# Altium schematic sheet Э3-9.SchDoc
size 594 x 420 mm; Address1: Address1; Address2: Address2; Address3: Address3; Address4: Address4; SheetNumber: 9; SheetTotal: 12; DocumentType: Схема электрическая принципиальная
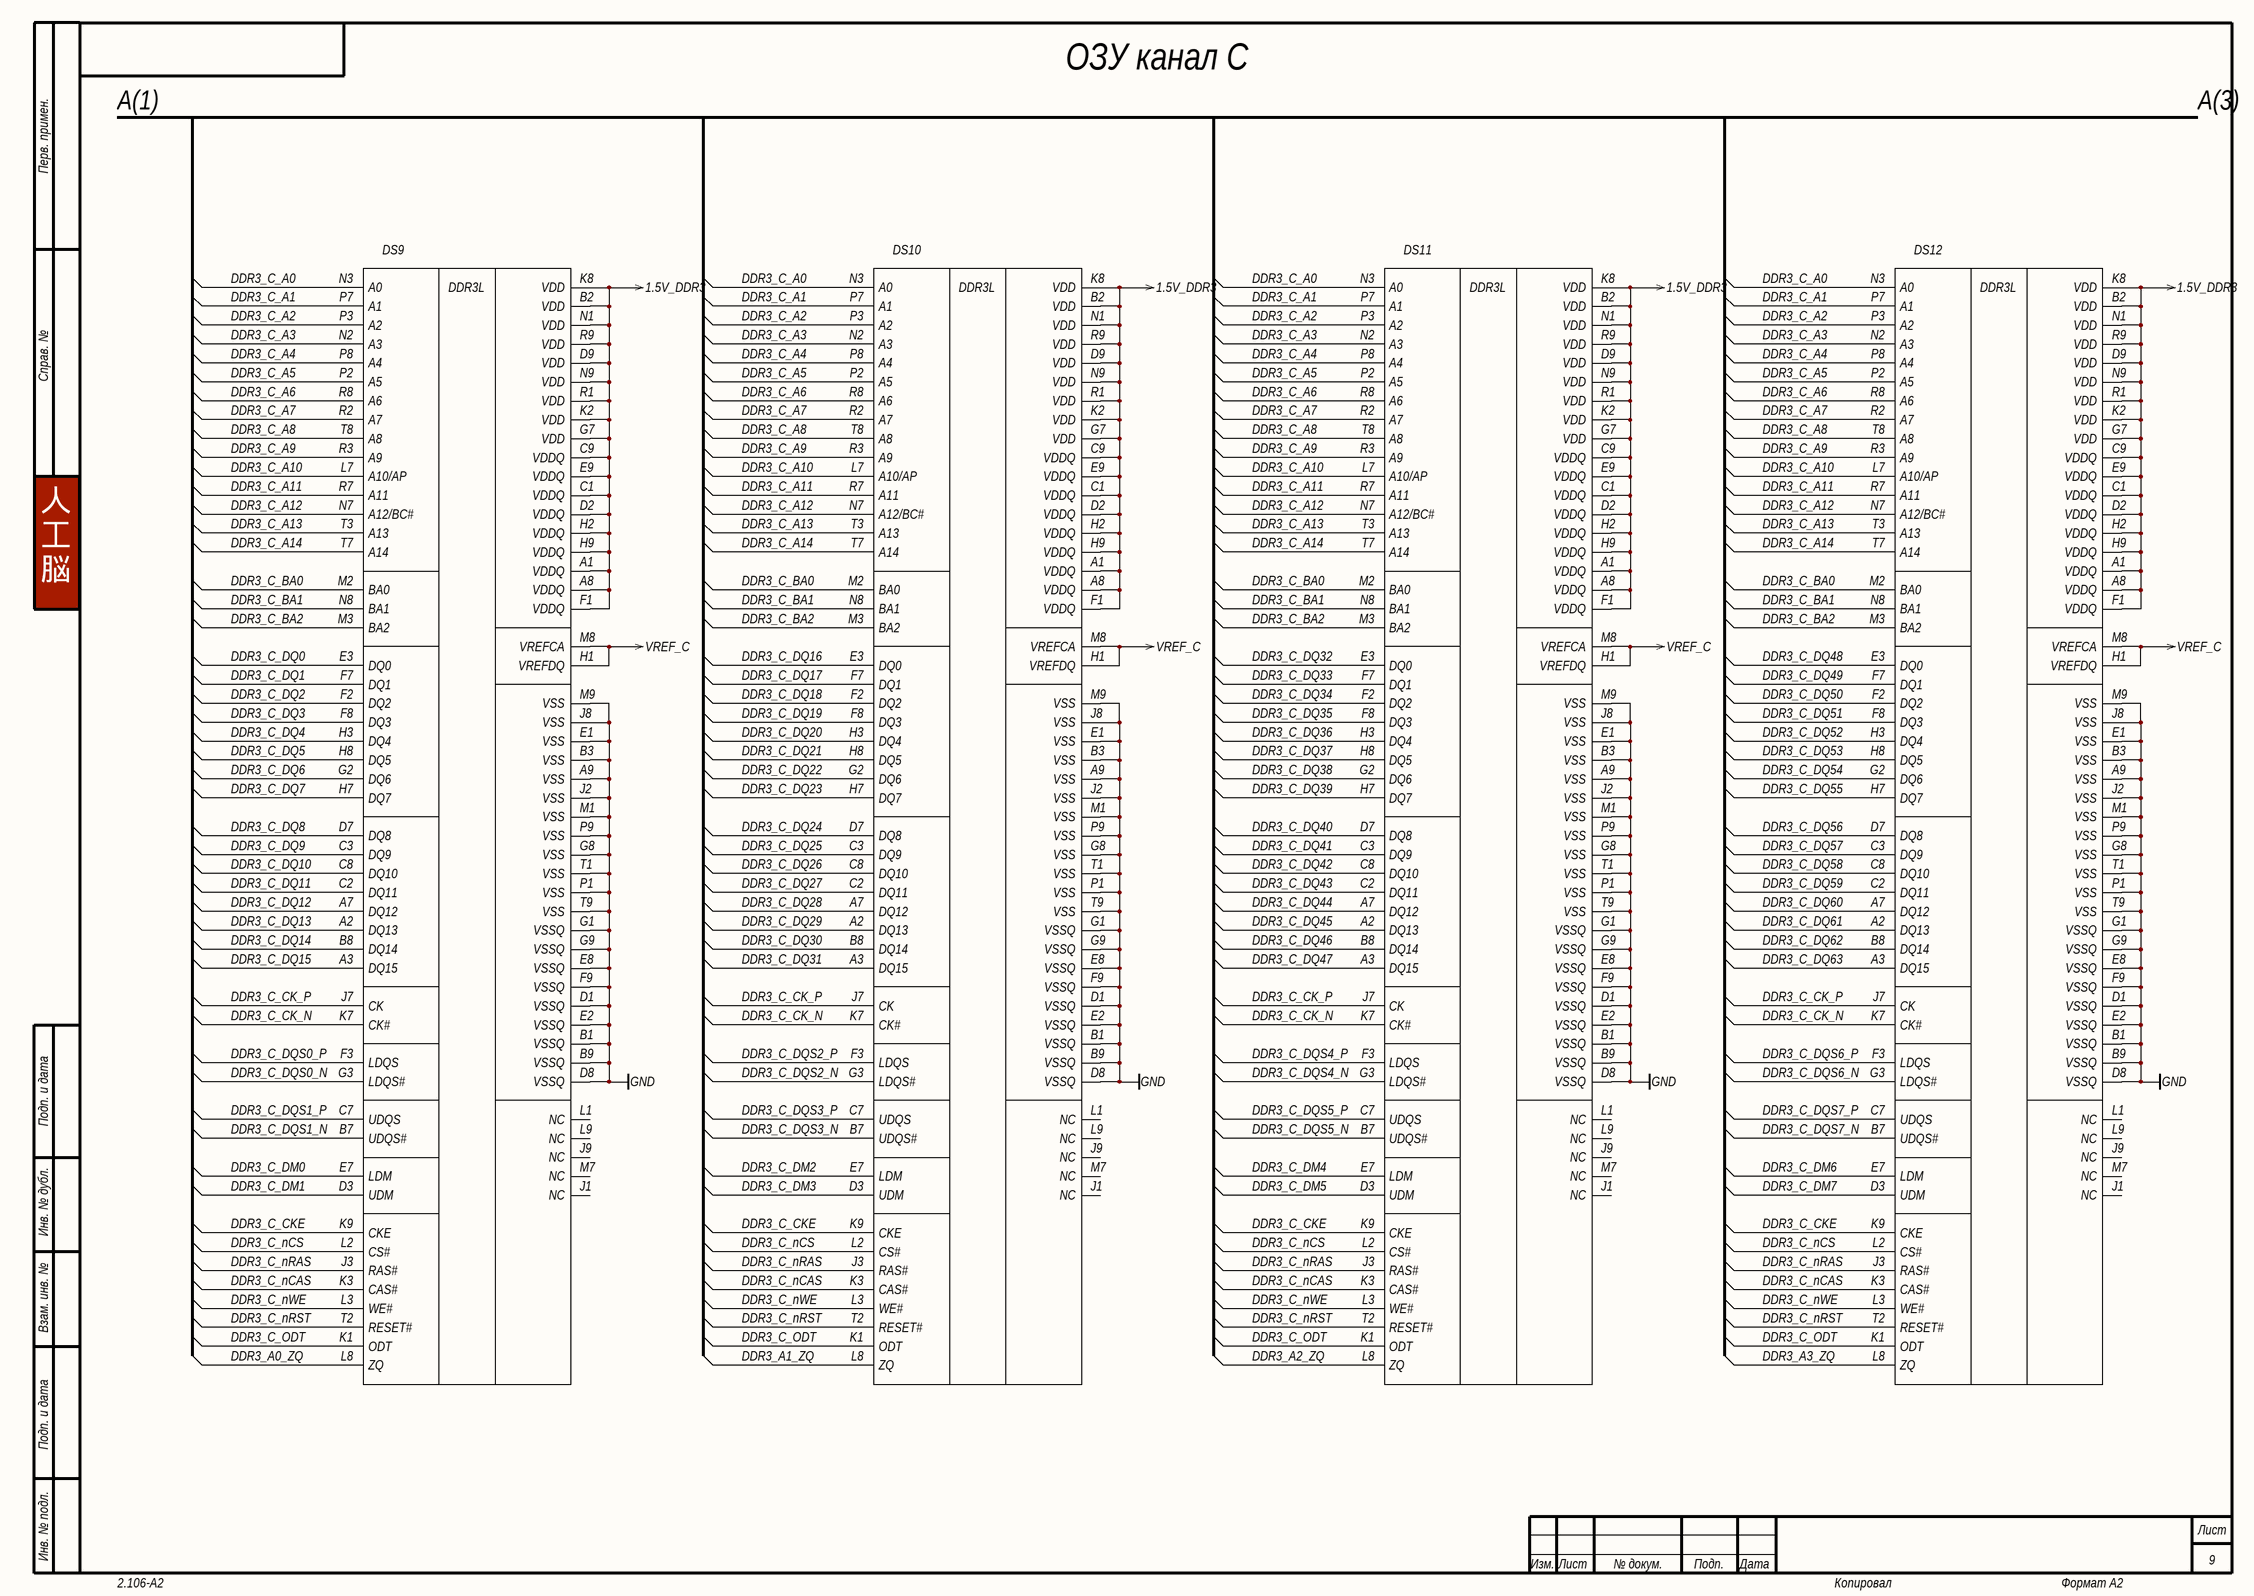
[diagram p0: Э3-9.SchDoc]

## Parts
DS9  1  [96-FBGA]  (value not drawn)
DS10  1  [96-FBGA]  (value not drawn)
DS11  1  [96-FBGA]  (value not drawn)
DS12  1  [96-FBGA]  (value not drawn)

## Nets
1.5V_DDR3: DS9.A1(VDDQ) DS9.A8(VDDQ) DS9.B2(VDD) DS9.C1(VDDQ) DS9.C9(VDDQ) DS9.D2(VDDQ) DS9.D9(VDD) DS9.E9(VDDQ) DS9.F1(VDDQ) DS9.G7(VDD) DS9.H2(VDDQ) DS9.H9(VDDQ) DS9.K2(VDD) DS9.K8(VDD) DS9.N1(VDD) DS9.N9(VDD) DS9.R1(VDD) DS9.R9(VDD) DS10.A1(VDDQ) DS10.A8(VDDQ) DS10.B2(VDD) DS10.C1(VDDQ) DS10.C9(VDDQ) DS10.D2(VDDQ) DS10.D9(VDD) DS10.E9(VDDQ) DS10.F1(VDDQ) DS10.G7(VDD) DS10.H2(VDDQ) DS10.H9(VDDQ) DS10.K2(VDD) DS10.K8(VDD) DS10.N1(VDD) DS10.N9(VDD) DS10.R1(VDD) DS10.R9(VDD) DS11.A1(VDDQ) DS11.A8(VDDQ) DS11.B2(VDD) DS11.C1(VDDQ) DS11.C9(VDDQ) DS11.D2(VDDQ) DS11.D9(VDD) DS11.E9(VDDQ) DS11.F1(VDDQ) DS11.G7(VDD) DS11.H2(VDDQ) DS11.H9(VDDQ) DS11.K2(VDD) DS11.K8(VDD) DS11.N1(VDD) DS11.N9(VDD) DS11.R1(VDD) DS11.R9(VDD) DS12.A1(VDDQ) DS12.A8(VDDQ) DS12.B2(VDD) DS12.C1(VDDQ) DS12.C9(VDDQ) DS12.D2(VDDQ) DS12.D9(VDD) DS12.E9(VDDQ) DS12.F1(VDDQ) DS12.G7(VDD) DS12.H2(VDDQ) DS12.H9(VDDQ) DS12.K2(VDD) DS12.K8(VDD) DS12.N1(VDD) DS12.N9(VDD) DS12.R1(VDD) DS12.R9(VDD)
GND: DS9.A9(VSS) DS9.B1(VSSQ) DS9.B3(VSS) DS9.B9(VSSQ) DS9.D1(VSSQ) DS9.D8(VSSQ) DS9.E1(VSS) DS9.E2(VSSQ) DS9.E8(VSSQ) DS9.F9(VSSQ) DS9.G1(VSSQ) DS9.G8(VSS) DS9.G9(VSSQ) DS9.J2(VSS) DS9.J8(VSS) DS9.M1(VSS) DS9.M9(VSS) DS9.P1(VSS) DS9.P9(VSS) DS9.T1(VSS) DS9.T9(VSS) DS10.A9(VSS) DS10.B1(VSSQ) DS10.B3(VSS) DS10.B9(VSSQ) DS10.D1(VSSQ) DS10.D8(VSSQ) DS10.E1(VSS) DS10.E2(VSSQ) DS10.E8(VSSQ) DS10.F9(VSSQ) DS10.G1(VSSQ) DS10.G8(VSS) DS10.G9(VSSQ) DS10.J2(VSS) DS10.J8(VSS) DS10.M1(VSS) DS10.M9(VSS) DS10.P1(VSS) DS10.P9(VSS) DS10.T1(VSS) DS10.T9(VSS) DS11.A9(VSS) DS11.B1(VSSQ) DS11.B3(VSS) DS11.B9(VSSQ) DS11.D1(VSSQ) DS11.D8(VSSQ) DS11.E1(VSS) DS11.E2(VSSQ) DS11.E8(VSSQ) DS11.F9(VSSQ) DS11.G1(VSSQ) DS11.G8(VSS) DS11.G9(VSSQ) DS11.J2(VSS) DS11.J8(VSS) DS11.M1(VSS) DS11.M9(VSS) DS11.P1(VSS) DS11.P9(VSS) DS11.T1(VSS) DS11.T9(VSS) DS12.A9(VSS) DS12.B1(VSSQ) DS12.B3(VSS) DS12.B9(VSSQ) DS12.D1(VSSQ) DS12.D8(VSSQ) DS12.E1(VSS) DS12.E2(VSSQ) DS12.E8(VSSQ) DS12.F9(VSSQ) DS12.G1(VSSQ) DS12.G8(VSS) DS12.G9(VSSQ) DS12.J2(VSS) DS12.J8(VSS) DS12.M1(VSS) DS12.M9(VSS) DS12.P1(VSS) DS12.P9(VSS) DS12.T1(VSS) DS12.T9(VSS)
VREF_C: DS9.H1(VREFDQ) DS9.M8(VREFCA) DS10.H1(VREFDQ) DS10.M8(VREFCA) DS11.H1(VREFDQ) DS11.M8(VREFCA) DS12.H1(VREFDQ) DS12.M8(VREFCA)
DDR3_A0_ZQ: DS9.L8(ZQ)
DDR3_A1_ZQ: DS10.L8(ZQ)
DDR3_A2_ZQ: DS11.L8(ZQ)
DDR3_A3_ZQ: DS12.L8(ZQ)
DDR3_C_A0: DS9.N3(A0) DS10.N3(A0) DS11.N3(A0) DS12.N3(A0)
DDR3_C_A1: DS9.P7(A1) DS10.P7(A1) DS11.P7(A1) DS12.P7(A1)
DDR3_C_A2: DS9.P3(A2) DS10.P3(A2) DS11.P3(A2) DS12.P3(A2)
DDR3_C_A3: DS9.N2(A3) DS10.N2(A3) DS11.N2(A3) DS12.N2(A3)
DDR3_C_A4: DS9.P8(A4) DS10.P8(A4) DS11.P8(A4) DS12.P8(A4)
DDR3_C_A5: DS9.P2(A5) DS10.P2(A5) DS11.P2(A5) DS12.P2(A5)
DDR3_C_A6: DS9.R8(A6) DS10.R8(A6) DS11.R8(A6) DS12.R8(A6)
DDR3_C_A7: DS9.R2(A7) DS10.R2(A7) DS11.R2(A7) DS12.R2(A7)
DDR3_C_A8: DS9.T8(A8) DS10.T8(A8) DS11.T8(A8) DS12.T8(A8)
DDR3_C_A9: DS9.R3(A9) DS10.R3(A9) DS11.R3(A9) DS12.R3(A9)
DDR3_C_A10: DS9.L7(A10/AP) DS10.L7(A10/AP) DS11.L7(A10/AP) DS12.L7(A10/AP)
DDR3_C_A11: DS9.R7(A11) DS10.R7(A11) DS11.R7(A11) DS12.R7(A11)
DDR3_C_A12: DS9.N7(A12/BC#) DS10.N7(A12/BC#) DS11.N7(A12/BC#) DS12.N7(A12/BC#)
DDR3_C_A13: DS9.T3(A13) DS10.T3(A13) DS11.T3(A13) DS12.T3(A13)
DDR3_C_A14: DS9.T7(A14) DS10.T7(A14) DS11.T7(A14) DS12.T7(A14)
DDR3_C_BA0: DS9.M2(BA0) DS10.M2(BA0) DS11.M2(BA0) DS12.M2(BA0)
DDR3_C_BA1: DS9.N8(BA1) DS10.N8(BA1) DS11.N8(BA1) DS12.N8(BA1)
DDR3_C_BA2: DS9.M3(BA2) DS10.M3(BA2) DS11.M3(BA2) DS12.M3(BA2)
DDR3_C_CK_N: DS9.K7(CK#) DS10.K7(CK#) DS11.K7(CK#) DS12.K7(CK#)
DDR3_C_CK_P: DS9.J7(CK) DS10.J7(CK) DS11.J7(CK) DS12.J7(CK)
DDR3_C_CKE: DS9.K9(CKE) DS10.K9(CKE) DS11.K9(CKE) DS12.K9(CKE)
DDR3_C_DM0: DS9.E7(LDM)
DDR3_C_DM1: DS9.D3(UDM)
DDR3_C_DM2: DS10.E7(LDM)
DDR3_C_DM3: DS10.D3(UDM)
DDR3_C_DM4: DS11.E7(LDM)
DDR3_C_DM5: DS11.D3(UDM)
DDR3_C_DM6: DS12.E7(LDM)
DDR3_C_DM7: DS12.D3(UDM)
DDR3_C_DQ0: DS9.E3(DQ0)
DDR3_C_DQ1: DS9.F7(DQ1)
DDR3_C_DQ2: DS9.F2(DQ2)
DDR3_C_DQ3: DS9.F8(DQ3)
DDR3_C_DQ4: DS9.H3(DQ4)
DDR3_C_DQ5: DS9.H8(DQ5)
DDR3_C_DQ6: DS9.G2(DQ6)
DDR3_C_DQ7: DS9.H7(DQ7)
DDR3_C_DQ8: DS9.D7(DQ8)
DDR3_C_DQ9: DS9.C3(DQ9)
DDR3_C_DQ10: DS9.C8(DQ10)
DDR3_C_DQ11: DS9.C2(DQ11)
DDR3_C_DQ12: DS9.A7(DQ12)
DDR3_C_DQ13: DS9.A2(DQ13)
DDR3_C_DQ14: DS9.B8(DQ14)
DDR3_C_DQ15: DS9.A3(DQ15)
DDR3_C_DQ16: DS10.E3(DQ0)
DDR3_C_DQ17: DS10.F7(DQ1)
DDR3_C_DQ18: DS10.F2(DQ2)
DDR3_C_DQ19: DS10.F8(DQ3)
DDR3_C_DQ20: DS10.H3(DQ4)
DDR3_C_DQ21: DS10.H8(DQ5)
DDR3_C_DQ22: DS10.G2(DQ6)
DDR3_C_DQ23: DS10.H7(DQ7)
DDR3_C_DQ24: DS10.D7(DQ8)
DDR3_C_DQ25: DS10.C3(DQ9)
DDR3_C_DQ26: DS10.C8(DQ10)
DDR3_C_DQ27: DS10.C2(DQ11)
DDR3_C_DQ28: DS10.A7(DQ12)
DDR3_C_DQ29: DS10.A2(DQ13)
DDR3_C_DQ30: DS10.B8(DQ14)
DDR3_C_DQ31: DS10.A3(DQ15)
DDR3_C_DQ32: DS11.E3(DQ0)
DDR3_C_DQ33: DS11.F7(DQ1)
DDR3_C_DQ34: DS11.F2(DQ2)
DDR3_C_DQ35: DS11.F8(DQ3)
DDR3_C_DQ36: DS11.H3(DQ4)
DDR3_C_DQ37: DS11.H8(DQ5)
DDR3_C_DQ38: DS11.G2(DQ6)
DDR3_C_DQ39: DS11.H7(DQ7)
DDR3_C_DQ40: DS11.D7(DQ8)
DDR3_C_DQ41: DS11.C3(DQ9)
DDR3_C_DQ42: DS11.C8(DQ10)
DDR3_C_DQ43: DS11.C2(DQ11)
DDR3_C_DQ44: DS11.A7(DQ12)
DDR3_C_DQ45: DS11.A2(DQ13)
DDR3_C_DQ46: DS11.B8(DQ14)
DDR3_C_DQ47: DS11.A3(DQ15)
DDR3_C_DQ48: DS12.E3(DQ0)
DDR3_C_DQ49: DS12.F7(DQ1)
DDR3_C_DQ50: DS12.F2(DQ2)
DDR3_C_DQ51: DS12.F8(DQ3)
DDR3_C_DQ52: DS12.H3(DQ4)
DDR3_C_DQ53: DS12.H8(DQ5)
DDR3_C_DQ54: DS12.G2(DQ6)
DDR3_C_DQ55: DS12.H7(DQ7)
DDR3_C_DQ56: DS12.D7(DQ8)
DDR3_C_DQ57: DS12.C3(DQ9)
DDR3_C_DQ58: DS12.C8(DQ10)
DDR3_C_DQ59: DS12.C2(DQ11)
DDR3_C_DQ60: DS12.A7(DQ12)
DDR3_C_DQ61: DS12.A2(DQ13)
DDR3_C_DQ62: DS12.B8(DQ14)
DDR3_C_DQ63: DS12.A3(DQ15)
DDR3_C_DQS0_N: DS9.G3(LDQS#)
DDR3_C_DQS0_P: DS9.F3(LDQS)
DDR3_C_DQS1_N: DS9.B7(UDQS#)
DDR3_C_DQS1_P: DS9.C7(UDQS)
DDR3_C_DQS2_N: DS10.G3(LDQS#)
DDR3_C_DQS2_P: DS10.F3(LDQS)
DDR3_C_DQS3_N: DS10.B7(UDQS#)
DDR3_C_DQS3_P: DS10.C7(UDQS)
DDR3_C_DQS4_N: DS11.G3(LDQS#)
DDR3_C_DQS4_P: DS11.F3(LDQS)
DDR3_C_DQS5_N: DS11.B7(UDQS#)
DDR3_C_DQS5_P: DS11.C7(UDQS)
DDR3_C_DQS6_N: DS12.G3(LDQS#)
DDR3_C_DQS6_P: DS12.F3(LDQS)
DDR3_C_DQS7_N: DS12.B7(UDQS#)
DDR3_C_DQS7_P: DS12.C7(UDQS)
DDR3_C_nCAS: DS9.K3(CAS#) DS10.K3(CAS#) DS11.K3(CAS#) DS12.K3(CAS#)
DDR3_C_nCS: DS9.L2(CS#) DS10.L2(CS#) DS11.L2(CS#) DS12.L2(CS#)
DDR3_C_nRAS: DS9.J3(RAS#) DS10.J3(RAS#) DS11.J3(RAS#) DS12.J3(RAS#)
DDR3_C_nRST: DS9.T2(RESET#) DS10.T2(RESET#) DS11.T2(RESET#) DS12.T2(RESET#)
DDR3_C_nWE: DS9.L3(WE#) DS10.L3(WE#) DS11.L3(WE#) DS12.L3(WE#)
DDR3_C_ODT: DS9.K1(ODT) DS10.K1(ODT) DS11.K1(ODT) DS12.K1(ODT)

Not connected (* = marked no-connect by the designer): DS9 J1(NC) J9(NC) L1(NC) L9(NC) M7(NC); DS10 J1(NC) J9(NC) L1(NC) L9(NC) M7(NC); DS11 J1(NC) J9(NC) L1(NC) L9(NC) M7(NC); DS12 J1(NC) J9(NC) L1(NC) L9(NC) M7(NC)

## Notes on the sheet
- A(1)
- ОЗУ канал C
- A(3)
- 人
  工
  脳
- Перв. примен.
- Справ. №
- Подп. и дата
- Инв. № дубл.
- Взам. инв. №
- Инв. № подл.
- Изм.
- Лист
- № докум.
- Подп.
- Дата
- 2.106-A2
- Копировал
- Формат А2
- (in symbol MT41K256M16TW-107IT:P) DDR3L

## Library data of the parts
DS9-DS12 = MT41K256M16TW-107IT:P: 32 Megx16x8 banks DDR3L SDRAM; Manufacturer: Micron Technology, Inc.; TemperatureRange: -...+°C; ComponentType: Микросхема; Install: 1